# EAGLE design WiDunio (EAGLE 6.6.0)
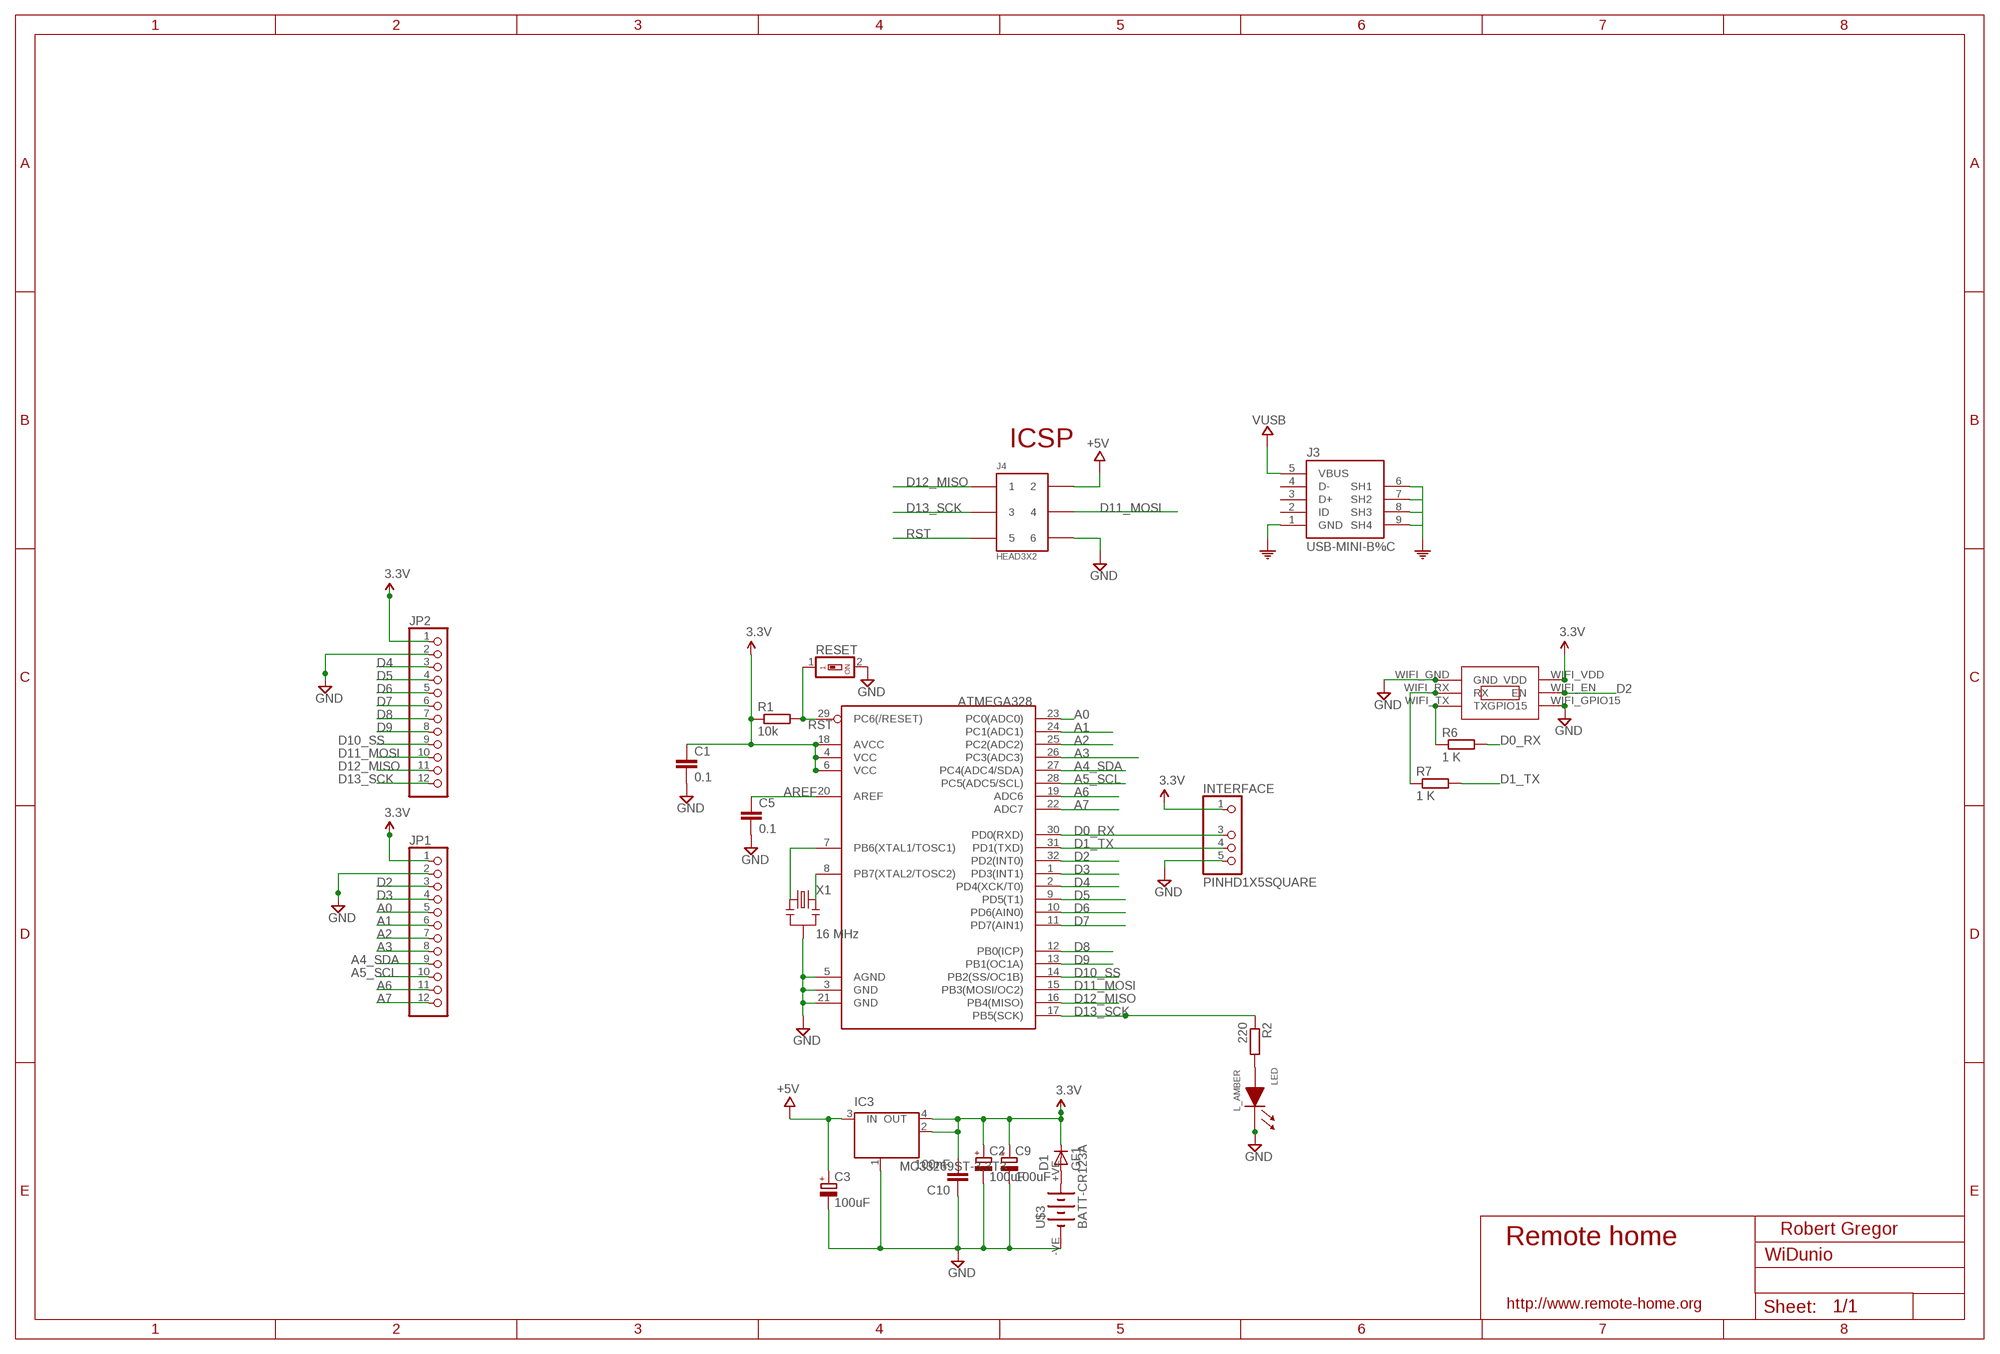
[diagram p0: schematic, sheet 1]

## Parts
ATMEGA328  ATMega-328  ATMEGA168/328TQFP32  [TQFP32-08]
C1  0.1  C-EUC2012  [C2012]
C2  100uF  CPOL-EUSMCB  [SMC_B]
C3  100uF  CPOL-EUSMCB  [SMC_B]
C5  0.1  C-EUC2012  [C2012]
C9  100uF  CPOL-EUSMCB  [SMC_B]
C10  100nF  C-EUC2012  [C2012]
D1  GF1  [SMA-DO214AC]
IC3  MC33269ST-3.3T3  [SOT223]
INTERFACE  PINHD1X5SQUARE  [PINHD1X05-SQUARE]
J3  USB-MINI-B%C  [USB-MINI-B_2]
J4  HEAD3X2  [HEAD3X2]
JP1  PINHD-1X12  [1X12]
JP2  PINHD-1X12  [1X12]
LED  L_AMBER  LED0805  [LED0805]
R1  10k  R-EU_R2012  [R2012]
R2  220  R-EU_M2012  [M2012]
R6  1 K  R-EU_M2012  [M2012]
R7  1 K  R-EU_M2012  [M2012]
RESET  SWS001  [SMS-001]
U$3  BATT-CR123A  [KEYSTONE-2/3A]
U$5  ESP03  [ESP03]
X1  16 MHz  RESONATORSMD  [RESONATOR-SMD]

## Nets
5V: C3.+ IC3.3(IN) J3.5(VBUS) J4.2 ; supply symbol labelled +5V, VUSB
A0: ATMEGA328.23(PC0(ADC0)) JP1.5
A1: ATMEGA328.24(PC1(ADC1)) JP1.6
A2: ATMEGA328.25(PC2(ADC2)) JP1.7
A3: ATMEGA328.26(PC3(ADC3)) JP1.8
A4_SDA: ATMEGA328.27(PC4(ADC4/SDA)) JP1.9
A5_SCL: ATMEGA328.28(PC5(ADC5/SCL)) JP1.10
A6: ATMEGA328.19(ADC6) JP1.11
A7: ATMEGA328.22(ADC7) JP1.12
AREF: ATMEGA328.20(AREF) C5.1
D0_RX: ATMEGA328.30(PD0(RXD)) INTERFACE.3 R6.2
D1_TX: ATMEGA328.31(PD1(TXD)) INTERFACE.4 R7.2
D2: ATMEGA328.32(PD2(INT0)) JP1.3 U$5.WIFI_EN(EN)
D3: ATMEGA328.1(PD3(INT1)) JP1.4
D4: ATMEGA328.2(PD4(XCK/T0)) JP2.3
D5: ATMEGA328.9(PD5(T1)) JP2.4
D6: ATMEGA328.10(PD6(AIN0)) JP2.5
D7: ATMEGA328.11(PD7(AIN1)) JP2.6
D8: ATMEGA328.12(PB0(ICP)) JP2.7
D9: ATMEGA328.13(PB1(OC1A)) JP2.8
D10_SS: ATMEGA328.14(PB2(SS/OC1B)) JP2.9
D11_MOSI: ATMEGA328.15(PB3(MOSI/OC2)) J4.4 JP2.10
D12_MISO: ATMEGA328.16(PB4(MISO)) J4.1 JP2.11
D13_SCK: ATMEGA328.17(PB5(SCK)) J4.3 JP2.12 R2.1
GND: ATMEGA328.3(GND) ATMEGA328.5(AGND) ATMEGA328.21(GND) C1.2 C2.- C3.- C5.2 C9.- C10.1 IC3.1(GND/ADJ) INTERFACE.5 J3.1(GND) J3.6(SH1) J3.7(SH2) J3.8(SH3) J3.9(SH4) J4.6 JP1.2 JP2.2 LED.1(CA) RESET.2 U$3.-VE(-) U$5.WIFI_GND(GND) U$5.WIFI_GPIO15(GPIO15) X1.2 ; supply symbol labelled COM
N$1: ATMEGA328.7(PB6(XTAL1/TOSC1)) X1.1
N$3: D1.A U$3.+VE(+)
N$4: LED.2(AN) R2.2
N$10: R6.1 U$5.WIFI_TX(TX)
N$11: R7.1 U$5.WIFI_RX(RX)
N$21: ATMEGA328.8(PB7(XTAL2/TOSC2)) X1.3
RST: ATMEGA328.29(PC6(/RESET)) J4.5 R1.2 RESET.1
VCC: ATMEGA328.4(VCC) ATMEGA328.6(VCC) ATMEGA328.18(AVCC) C1.1 C2.+ C9.+ C10.2 D1.K(C) IC3.2(OUT) IC3.4(OUT) INTERFACE.1 JP1.1 JP2.1 R1.1 U$5.WIFI_VDD(VDD) ; supply symbol labelled 3.3V
Unconnected: J3.2(ID) J3.3(D+) J3.4(D-)

## Notes on the sheet
- ICSP
- Robert Gregor
- Remote home
- http://www.remote-home.org

## Library data of the parts
ATMEGA328 = LowPowerLab:ATMEGA168/328: Atmel 32-pin 8-bit micro, 16k flash.
C1 C5 C10 = resistor:C-EU: CAPACITOR, European symbol
C2 C3 C9 = resistor:CPOL-EU: POLARIZED CAPACITOR, European symbol
D1 = diode:GF1: DIODE
IC3 = linear:MC33269ST*: Adjustable Output Low Dropout Voltage Regulator 800 mA Source: http://www.onsemi.com/pub/Collateral/MC33269-D.PDF
INTERFACE = eagle-library-edeca.net-v5:PINHD1X5
J3 = MyCON2:USB-MINI-B
J4 = MyCON2:HEAD3X2
JP1 JP2 = pinhead:PINHD-1X12: PIN HEADER
LED = MySMD:LED0805
R1 R2 R6 R7 = resistor:R-EU_: RESISTOR, European symbol
RESET = smd-special:SWS001: SMD Dip Switch 1 pol.
U$3 = eagle-library-edeca.net-v5:BATT-CR123A: CR123A (2/3rd AA) battery holder Manufacturer: Keystone Mouser part: 534-1019
U$5 = RemoteHome:ESP03
X1 = SparkFun:RESONATOR: Resonator Small SMD resonator. This is the itty bitty 10/20MHz resonators with built in caps. CSTCE10M0G55 and CSTCE20M0V53. Footprint has been reviewed closely but hasn't been tested yet.

## Net classes
1 power: width 0.381 mm, clearance 0.254 mm

## Board
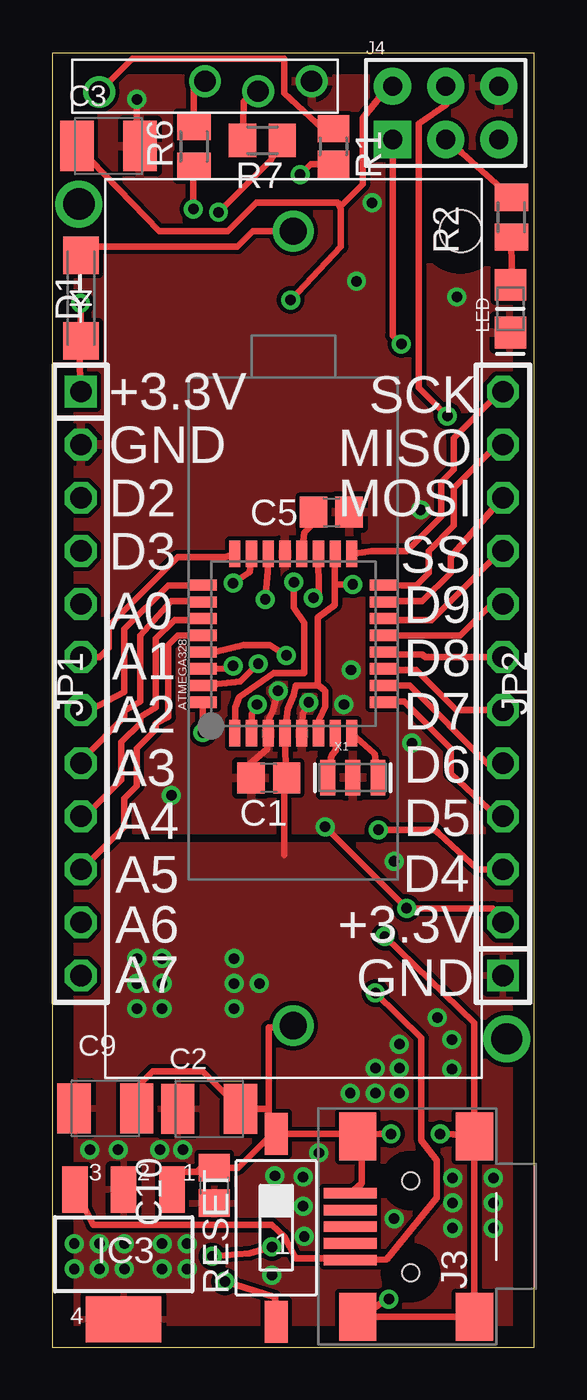
[diagram p1: board, top side]
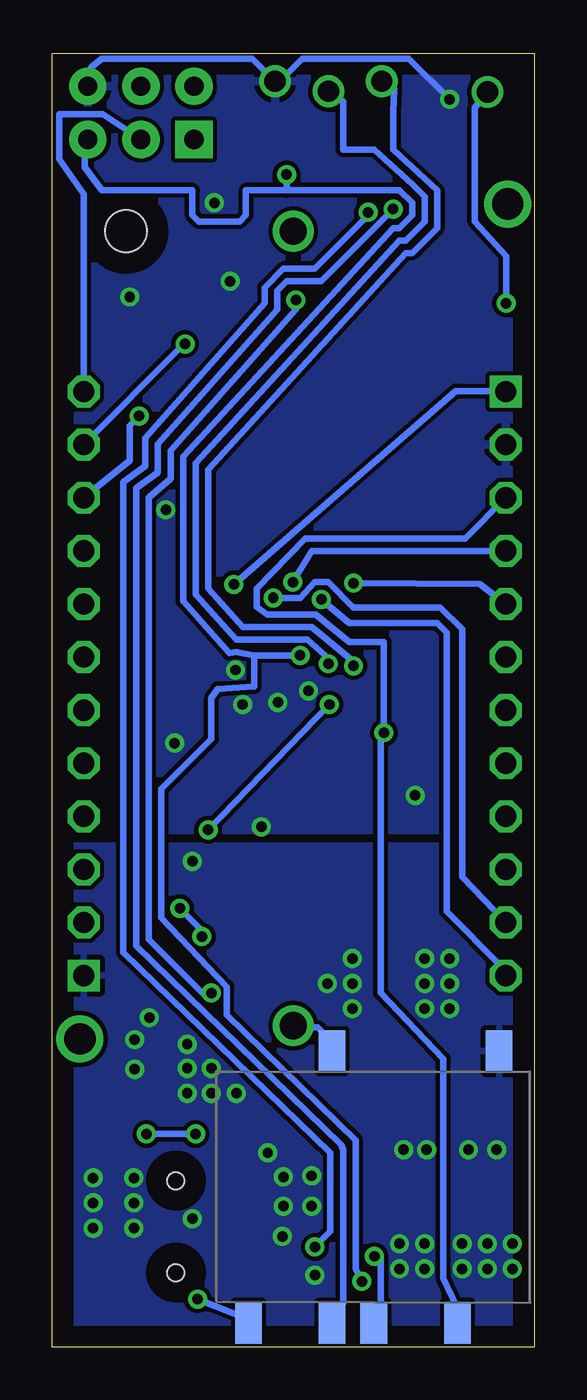
[diagram p2: board, bottom side, seen from below]

Size 23.05 x 61.9 mm. Coordinates in mm from the lower left corner, seen from the top.
Outline: 0,0 23.05,0 23.05,61.9 0,61.9 0,0
Copper layers (1*16): Top 0.035mm / dielectric 1.5mm / Bottom 0.035mm
Design rules "default": minimum track width 10mil, minimum drill 24mil, track to track 8mil, track to pad 8mil, pad to pad 8mil, via to via 8mil, smd to smd 8mil, copper to edge 40mil, drill to drill 8mil, minimum pad ring 10mil, minimum via ring 8mil, stop-mask expansion 4mil, vias tented up to drill 0mil, thermal gap 10mil

### Footprints (pad centres in the part's own frame; a part is rotated, then mirrored left to right if it is on the bottom)
TQFP32-08 = smd 1.27 x 0.533: 1 -4.293,2.8; 2 -4.293,2; 3 -4.293,1.2; 4 -4.293,0.4; 5 -4.293,-0.4; 6 -4.293,-1.2; 7 -4.293,-2; 8 -4.293,-2.8; 17 4.293,-2.8; 18 4.293,-2; 19 4.293,-1.2; 20 4.293,-0.4; 21 4.293,0.4; 22 4.293,1.2; 23 4.293,2; 24 4.293,2.8 | smd 0.533 x 1.27: 9 -2.8,-4.293; 10 -2,-4.293; 11 -1.2,-4.293; 12 -0.4,-4.293; 13 0.4,-4.293; 14 1.2,-4.293; 15 2,-4.293; 16 2.8,-4.293; 25 2.8,4.293; 26 2,4.293; 27 1.2,4.293; 28 0.4,4.293; 29 -0.4,4.293; 30 -1.2,4.293; 31 -2,4.293; 32 -2.8,4.293
C2012 = smd 1.3 x 1.5: 1 -0.85,0; 2 0.85,0
SMC_B = smd 1.6 x 2.4: + -1.5,0; - 1.5,0
SMA-DO214AC = smd 1.8 x 1.7: A -2.05,0; K 2.05,0
SOT223 = smd 1.219 x 2.235: 1 -2.311,-3.099; 2 0,-3.099; 3 2.311,-3.099 | smd 3.6 x 2.2: 4 0,3.099
PINHD1X05-SQUARE = drill 1.016: 1 -5.061,-0.269; 3 0,0.24; 4 2.54,-0.24; 5 5.099,0.24
USB-MINI-B_2 = smd 0.508 x 2.54: 1 0,0; 2 0.8,0; 3 1.6,0; 4 2.4,0; 5 3.2,0 | smd 2.286 x 1.778: 6 -2.717,5.948; 7 -2.717,0.36; 8 5.918,0.36; 9 5.918,5.948 | hole 0.813: -0.6,2.9; 3.8,2.9
HEAD3X2 = drill 0.914 pad 1.778 square: 1 0,0 | drill 0.914 pad 1.778: 2 0,2.54; 3 2.54,0; 4 2.54,2.54; 5 5.08,0; 6 5.08,2.54
1X12 = drill 1.016 square: 1 -13.97,0 | drill 1.016 octagon: 2 -11.43,0; 3 -8.89,0; 4 -6.35,0; 5 -3.81,0; 6 -1.27,0; 7 1.27,0; 8 3.81,0; 9 6.35,0; 10 8.89,0; 11 11.43,0; 12 13.97,0
LED0805 = smd 1.524 x 1.524: 1 0,0; 2 2.286,0
R2012 = smd 1.3 x 1.5: 1 -0.85,0; 2 0.85,0
M2012 = smd 1.3 x 1.6: 1 -0.95,0; 2 0.95,0
SMS-001 = smd 1.092 x 2.007: 1 0,-4.496; 2 0,4.496
KEYSTONE-2/3A = drill 1.3: +VE 0,19; -VE 0,-19 | hole 2: 8,19
ESP03 = smd 1.27 x 2: WIFI_EN 3.27,-6; WIFI_GND -6.73,-6; WIFI_GPIO15 -2.73,7; WIFI_RX -0.73,-6; WIFI_TX -2.73,-6; WIFI_VDD 5.27,7
RESONATOR-SMD = smd 0.7 x 1.7: 1 -1.2,0; 2 0,0; 3 1.2,0

### Placement (x,y rotation side)
ATMEGA328  11.53,33.66 90 top
C1  10.36,27.23 180 top
C2  7.5,11.4 0 top
C3  2.69,57.47 0 top
C5  13.35,39.95 0 top
C9  2.54,11.43 0 top
C10  7.74,7.74 270 top
D1  1.37,50.19 270 top
IC3  3.41,4.45 180 top
INTERFACE  7.3,60.33 0 top
J3  14.24,7.37 270 top
J4  16.27,57.78 0 top
JP1  1.37,31.75 270 top
JP2  21.55,31.75 90 top
LED  21.91,48.54 90 top
R1  13.44,57.45 270 top
R2  21.96,54.06 270 top
R6  6.77,57.45 90 top
R7  10.05,57.74 180 top
RESET  10.71,5.71 0 top
U$3  11.53,34.39 0 top
U$5  6.95,7.17 0 bottom
X1  14.37,27.25 0 top

### Tracks (layer width: path | path; a pad name or v marks a point on that pad's centre or on a via)
5V  (via drill 0.5)
  Top 0.305: J4.2 16.04,60.29 14.85,58.8 14.85,55.65 13.8,54.6 13.65,54.75 | 13.65,54.75 9.75,54.75 8.4,53.4 5.11,53.4 C3.+ | IC3.3 1.95,5.85 10.5,5.85 11.1,5.3 11.65,4.25 14,4.25 J3.5 16,4.2 18.38,7.15 18.38,8.95 17.65,9.9 17.65,14.8 v15.45,16.95 | v11.4,50.1 13.8,52.65 13.8,54.45 13.65,54.75
  Bottom 0.305: v15.45,16.95 15.75,16.8 18.45,19.5 18.45,40.65 17.4,41.55 17.4,42.9 11.4,49.65 v11.4,50.1
A0  (via drill 0.5)
  Top 0.305: v8.65,36.56 9.45,37.08 ATMEGA328.23
  Bottom 0.305: JP1.5 2.62,36.52 v8.65,36.56
A1
  Top 0.305: JP1.6 2.27,33.02 2.7,33.45 2.7,34.5 6,37.8 8.28,37.8 ATMEGA328.24
A2
  Top 0.305: JP1.7 1.87,30.52 3.45,31.35 3.45,34.35 5.55,36.45 7.13,36.45 ATMEGA328.25
A3
  Top 0.305: JP1.8 1.57,28.27 3.45,30.15 3.45,30.45 4.2,30.9 4.2,34.05 5.7,35.7 7.1,35.7 ATMEGA328.26
A4_SDA
  Top 0.305: JP1.9 1.55,25.4 3.3,27.15 3.3,28.95 4.2,29.85 4.2,30.15 4.95,30.6 4.95,33.9 5.85,34.8 7.08,34.8 ATMEGA328.27
A5_SCL
  Top 0.305: JP1.10 1.56,23.01 3.45,24.9 3.45,26.25 4.05,26.85 4.05,28.65 4.95,29.55 4.95,29.85 5.55,30.15 5.55,33.6 6,34.05 7.13,34.05 ATMEGA328.28
A6  (via drill 0.5)
  Top 0.305: v12.49,35.85 12.73,36.12 ATMEGA328.19
  Bottom 0.305: JP1.11 3.45,22.5 3.45,34.35 4.5,35.4 8.65,35.4 9.85,36.6 10.5,36.6 11.2,35.85 v12.49,35.85
A7  (via drill 0.5)
  Top 0.305: v10.19,35.78 10.3,37.12 ATMEGA328.22
  Bottom 0.305: JP1.12 1.58,18.23 4.2,20.85 4.2,34.2 4.65,34.65 8.85,34.65 v10.19,35.78
AREF
  Top 0.305: C5.1 12.54,39.45 12.06,38.98 ATMEGA328.20
D0_RX  (via drill 0.5)
  Top 0.305: R6.2 6.77,60.19 INTERFACE.3 | v8.65,32.6 8.33,32.45 ATMEGA328.30
  Bottom 0.305: INTERFACE.3 6.7,60.2 6.75,59.1 6.75,57.3 4.65,55.35 4.65,53.55 5.85,52.35 6.15,52.35 15.6,42 15.6,36.3 13.95,34.45 10.65,34.45 8.7,32.85 v8.65,32.6
D1_TX  (via drill 0.5)
  Top 0.305: R7.2 9.15,59.58 INTERFACE.4 | ATMEGA328.31 8.99,31.86 v9.85,32.7
  Bottom 0.305: v9.85,32.7 10,33.1 10.85,33.85 14.25,33.85 16.2,36 16.2,42.3 6.45,52.95 6.15,52.95 5.25,53.85 5.25,55.05 5.85,55.65 7.65,57.3 9.15,57.3 9.15,59.58 INTERFACE.4
D2  (via drill 0.5)
  Top 0.305: v7.2,29.4 7.2,30.8 ATMEGA328.32
  Bottom 0.305: JP1.3 3.3,38.7 10.95,38.7 13.29,36.3 13.27,35.42 12.77,35.06 10.45,35.05 8.85,33.75 7.2,33.75 v7.2,29.4 7.35,29.25 7.35,16.95 4.35,13.8 4.35,3.3 3.68,1.88 U$5.WIFI_EN
D3  (via drill 0.5)
  Top 0.305: ATMEGA328.1 8.75,30.6 8.95,31.1 10.6,32.25 12.05,32.25 12.05,34.65 11.55,35.4 v11.55,36.6
  Bottom 0.305: v11.55,36.6 10.65,38.1 JP1.4
D4  (via drill 0.5)
  Top 0.305: JP2.3 20.34,22.86 18.45,24.6 18.3,24.75 v15.6,24.75 | v9.8,30.75 9.55,30.3 9.55,29.84 ATMEGA328.2
  Bottom 0.305: v15.6,24.75 v9.8,30.75
D5
  Top 0.305: JP2.4 21.25,25.4 19.05,27.45 19.05,28.65 16.84,30.89 16.63,30.9 ATMEGA328.9
D6
  Top 0.305: JP2.5 20.81,27.94 17.1,31.65 16.7,31.66 ATMEGA328.10
D7
  Top 0.305: JP2.6 19.32,30.48 17.4,32.4 16.63,32.41 ATMEGA328.11
D8
  Top 0.305: JP2.7 17.83,33.02 17.7,33.15 15.83,33.15 ATMEGA328.12
D9
  Top 0.305: JP2.8 21.01,35.56 19.5,34.05 16.52,34.05 ATMEGA328.13
D10_SS
  Top 0.305: JP2.9 21.45,38.1 18.15,34.8 16.61,34.8 ATMEGA328.14
D11_MOSI  (via drill 0.5)
  Top 0.305: JP2.10 19.05,37.8 19.05,37.05 17.7,35.7 16.64,35.7 ATMEGA328.15 | J4.4 18.83,59.45 17.53,58.53 17.53,45.92 v18.9,44.55
  Bottom 0.305: v18.9,44.55 19.35,44.1 19.35,42.43 JP2.10
D12_MISO  (via drill 0.5)
  Top 0.305: JP2.11 21.28,43.18 19.2,41.1 19.2,39.3 18,38.1 18,37.05 17.4,36.45 16.73,36.45 ATMEGA328.16 | J4.1 16.27,48.41 v16.7,48
  Bottom 0.305: v16.7,48 16.92,47.85 JP2.11
D13_SCK
  Top 0.305: JP2.12 21.42,45.72 19.2,43.5 19.2,42 18.6,41.4 18.6,39.75 16.95,38.1 15.28,38.1 ATMEGA328.17 | J4.3 19.58,57.15 R2.1
  Bottom 0.305: JP2.12 21.55,55.16 22.73,56.85 22.73,59 20.65,59 J4.3
GND  (via drill 0.5)
  Top 0.305: ATMEGA328.5 11.98,30.33 v12.27,30.85 | v10.8,31.4 10.55,30.45 10.38,30.08 ATMEGA328.3 10.28,28.63 9.45,27.9 9.45,27.33 C1.2 | v4.05,59.7 4.05,57.48 C3.- | 14.8,10.21 RESET.2 11.24,10.21 10.35,10.2 | 14.8,10.21 J3.7 15.69,10.2 v16.2,10.2 | J3.6 19.19,10.19 v18.55,10.2 | 14.8,10.21 14.8,7.85 J3.1 | J3.6 J3.9 J3.8 15.45,1.92 15.9,2.25 v16.1,2.3 | IC3.1 6.12,8.37 6.15,8.4 6.9,8.4 7.09,8.59 C10.1 8.89,8.59 10.35,10.05 10.35,10.2 | C9.- 4.04,12.44 4.8,13.2 7.2,13.2 C2.- 10.35,11.4 | 10.35,10.2 10.35,11.4 | 10.35,11.4 10.35,15.3 11.42,15.3 U$3.-VE | J3.6 20.35,10.19 20.18,11 20.18,15.52 v15.9,19.65 | JP2.2 21.06,21 v16.95,21 v13.05,24.9
  Bottom 0.305: v4.05,59.7 6,61.65 11.1,61.65 12.19,60.56 INTERFACE.5 13.49,61.65 20.7,61.65 21.2,61.25 21.33,60.7 J4.6 | U$5.WIFI_GPIO15 9.68,14.63 10.35,15.3 11.42,15.3 U$3.-VE | v18.55,10.2 v16.2,10.2 | U$5.WIFI_GND 13.62,1.32 v16.1,2.3 | v15.9,19.65 15.9,19.95 v16.95,21
  other vias: 5.7,26.4 13.95,30.75 14.29,32.4 17.62,40.06 14.55,51 19.35,50.25 15.3,54.75 17.2,28.9
  pour Bottom: 22.7,24.75 0.45,24.75 0.45,61.5 22.7,61.5
  pour Top: 0.45,61.5 22.7,61.5 22.7,24.75 0.45,24.75
N$1
  Top 0.305: X1.1 13.32,28.17 13.4,28.35 13.55,28.55 ATMEGA328.7
N$2  (via drill 1.5)
  other vias: 21.74,14.75
N$3
  Top 0.305: U$3.+VE 9.59,53.39 8.85,52.65 1.63,52.65 D1.A
N$4
  Top 0.305: R2.2 21.97,51.48 LED.2
N$5  (via drill 1.5)
  other vias: 1.27,54.7
N$10  (via drill 0.5)
  Top 0.305: v6.75,54.45 6.75,56.48 R6.1
  Bottom 0.305: U$5.WIFI_TX 9.3,1.95 9.15,2.1 9.15,9.45 9.23,9.68 19.05,19.2 19.05,41.1 18,41.85 18,43.2 12.3,49.65 12.3,50.55 11.85,51 10.2,51 v6.75,54.45
N$11  (via drill 0.5)
  Top 0.305: R7.1 10.44,56.79 v7.95,54.3 | v10.5,4.8 9.45,4.5 v7.65,4.35
  Bottom 0.305: v7.95,54.3 7.95,54.15 10.5,51.6 12,51.6 12.9,50.7 12.9,49.95 18.6,43.5 18.6,42.15 19.65,41.4 19.65,18.9 9.75,9.3 9.75,5.55 v10.5,4.8 | v7.65,4.35 7.35,4.35 7.35,1.65 7.5,1.5 U$5.WIFI_RX
N$21
  Top 0.305: X1.3 15.42,28.38 ATMEGA328.8
RST  (via drill 0.5)
  Top 0.305: ATMEGA328.29 7.76,33.26 9.15,33.6 10.4,33.6 v11.2,33.1 | R1.2 12.35,56.6 v11.85,56.1 | RESET.1 10.66,2.39 v8.25,3.15
  Bottom 0.305: v11.2,33.1 13.4,33.1 | 13.4,33.1 14.25,33.25 14.6,33.21 16.8,35.7 16.8,42.6 6.75,53.55 6.45,53.55 5.85,54.15 5.85,54.75 6.45,55.35 11.85,55.35 | 11.85,55.35 13.8,55.35 13.8,54.15 14.1,53.85 16.05,53.85 16.35,54.15 16.35,55.35 20.7,55.35 21.5,56.45 21.5,57.46 J4.5 | v11.85,56.1 11.85,55.35 | v8.25,3.15 8.55,3.75 8.55,9.9 14.7,15.9 14.7,17.25 17.85,20.55 17.85,26.7 15.45,29.1 15.45,31.05 15.15,31.5 13.4,31.61 13.4,33.1
VCC  (via drill 0.5)
  Top 0.305: ATMEGA328.6 12.78,30.03 13.05,30.65 13.05,31.4 13,31.45 12.75,31.65 | 12.75,31.65 11.65,31.65 11.55,31.2 11.25,30.54 ATMEGA328.4 11.16,27.84 C1.1 11.1,27.34 11.1,23.55 | R1.1 12.95,58.3 11.1,60 11.1,61.65 3.84,61.65 INTERFACE.1 | JP1.1 1.27,48.19 D1.K 1.37,49.78 v1.35,49.95 | ATMEGA328.18 13.5,37.95 13.5,36.5 | 13.5,36.5 13.5,35.5 12.7,34.9 12.7,31.7 12.75,31.65 | v14.37,36.5 13.5,36.5
  Bottom 0.305: v1.35,49.95 1.35,52.2 2.85,53.85 2.85,59.3 INTERFACE.1 | v14.37,36.5 3.75,45.75 2.05,45.75 JP1.1
  other vias: 4.05,16.2 3.45,3.75 5.25,16.2 10.5,3.45 19.15,5.7 21.1,5.7 2.25,3.75 2.25,4.95 6.45,4.95 6.45,3.75 5.25,3.75 5.25,4.95 3.45,4.95 4.05,17.4 5.25,17.4 5.25,18.6 4.05,18.6 8.7,18.6 16.35,23.25 9.9,17.4 8.7,17.4 8.7,16.2 18.41,15.77 19.11,14.72 19.11,13.3 19.15,6.9 21.1,6.9 21.1,8.1 19.15,8.1 3.15,9.45 1.8,9.45 5.15,9.45 6.25,9.45 10.65,6.75 12,8.15 12.75,9.3 12,6.75 12.05,5.3 16.35,6.15 10.65,8.2 16.6,14.5 16.6,13.35 16.6,12.15 15.45,13.35 15.45,12.15 14.25,12.15 1.05,4.95 1.05,3.75
  pour Top: 22.8,0.3 22.8,24 0.3,24 0.3,0.3
  pour Bottom: 0.3,0.3 22.8,0.3 22.8,24 0.3,24

### Text on the board
tNames: +3.3V | SCK | GND | MISO | D2 | MOSI | D3 | SS | D9 | A0 | A1 | D8 | D7 | A2 | A3 | D6 | A4 | D5 | D4 | A5 | A6 | +3.3V | A7 | GND